# Altium schematic sheet summing_circuit.SchDoc
size A4
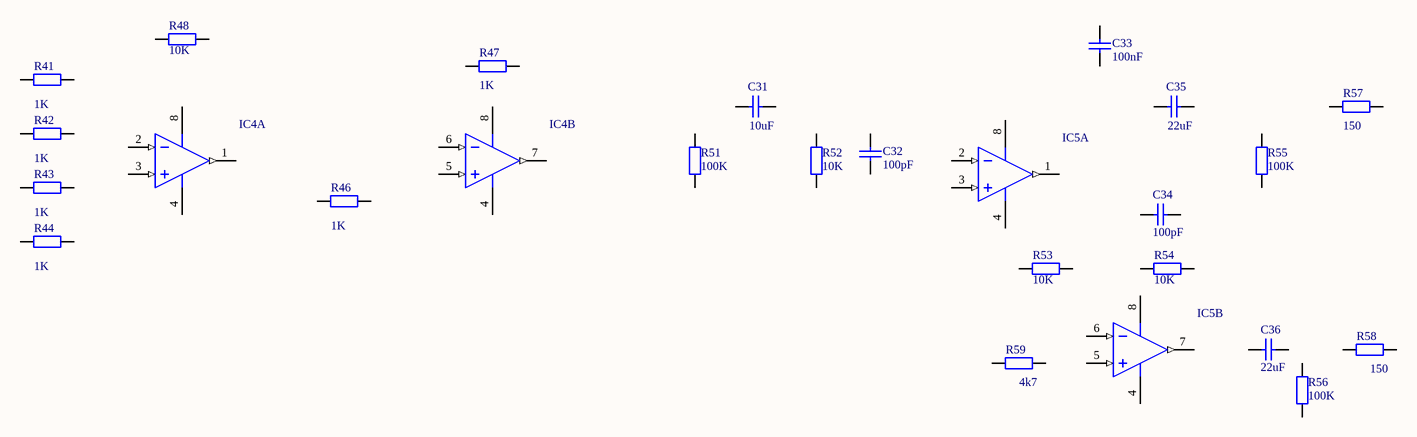
[diagram p0: summing_circuit.SchDoc]

## Parts
C31  value 10uF  [RAD-0.3]  (hidden comment: Cap)
C32  value 100pF  [RAD-0.3]  (hidden comment: Cap)
C33  value 100nF  [RAD-0.3]  (hidden comment: Cap)
C34  value 100pF  [RAD-0.3]  (hidden comment: Cap)
C35  value 22uF  [RAD-0.3]  (hidden comment: Cap)
C36  value 22uF  [RAD-0.3]  (hidden comment: Cap)
IC4  LM833DR2G  [ONSC-SOIC-8-751-07_V]  (value not drawn)  (parts A,B of 2)
IC5  LM833DR2G  [ONSC-SOIC-8-751-07_V]  (value not drawn)  (parts A,B of 2)
R41  value 1K  [AXIAL-0.4]  (hidden comment: Res2)
R42  value 1K  [AXIAL-0.4]  (hidden comment: Res2)
R43  value 1K  [AXIAL-0.4]  (hidden comment: Res2)
R44  value 1K  [AXIAL-0.4]  (hidden comment: Res2)
R46  value 1K  [AXIAL-0.4]  (hidden comment: Res2)
R47  value 1K  [AXIAL-0.4]  (hidden comment: Res2)
R48  value 10K  [AXIAL-0.4]  (hidden comment: Res2)
R51  value 100K  [AXIAL-0.4]  (hidden comment: Res2)
R52  value 10K  [AXIAL-0.4]  (hidden comment: Res2)
R53  value 10K  [AXIAL-0.4]  (hidden comment: Res2)
R54  value 10K  [AXIAL-0.4]  (hidden comment: Res2)
R55  value 100K  [AXIAL-0.4]  (hidden comment: Res2)
R56  value 100K  [AXIAL-0.4]  (hidden comment: Res2)
R57  value 150  [AXIAL-0.4]  (hidden comment: Res2)
R58  value 150  [AXIAL-0.4]  (hidden comment: Res2)
R59  value 4k7  [AXIAL-0.4]  (hidden comment: Res2)

## Nets

Not connected (* = marked no-connect by the designer): C31 1 2; C32 1 2; C33 1 2; C34 1 2; C35 1 2; C36 1 2; IC4 1(OUT1) 2(IN1-) 3(IN1+) 4(VEE) 5(IN2+) 6(IN2-) 7(OUT2) 8(VCC); IC5 1(OUT1) 2(IN1-) 3(IN1+) 4(VEE) 5(IN2+) 6(IN2-) 7(OUT2) 8(VCC); R41 1 2; R42 1 2; R43 1 2; R44 1 2; R46 1 2; R47 1 2; R48 1 2; R51 1 2; R52 1 2; R53 1 2; R54 1 2; R55 1 2; R56 1 2; R57 1 2; R58 1 2; R59 1 2

## Library data of the parts
C31 C32 C34 C35 = Cap: Capacitor; Published: 8-Jun-2000; LatestRevisionDate: 17-Jul-2002; LatestRevisionNote: Re-released for DXP Platform.; PackageReference: RAD-0.3; Publisher: Altium Limited; PackageDescription: Radial Cap, Thru-Hole; 2 Leads; 0.3 in Pin Spacing
C33 = Cap_3: Capacitor; Published: 8-Jun-2000; LatestRevisionDate: 17-Jul-2002; LatestRevisionNote: Re-released for DXP Platform.; PackageReference: RAD-0.3; Publisher: Altium Limited; PackageDescription: Radial Cap, Thru-Hole; 2 Leads; 0.3 in Pin Spacing
C36 = Cap_5: Capacitor; Published: 8-Jun-2000; LatestRevisionDate: 17-Jul-2002; LatestRevisionNote: Re-released for DXP Platform.; PackageReference: RAD-0.3; Publisher: Altium Limited; PackageDescription: Radial Cap, Thru-Hole; 2 Leads; 0.3 in Pin Spacing
IC4 IC5 = opamp_LM833: Low Noise, Audio Dual Operational Amplifier, -40 to 85 degC, 8-Pin SOIC, Pb-Free, Tape and Reel; Manufacturer: On Semiconductor; GBW Typ (MHz): 15; SR Typ (V/uS): 7; PackageReference: SOIC-8-751-07; ComponentLink3URL: http://www.onsemi.com/pub_link/Collateral/751-07.PDF; ComponentLink2URL: http://www.onsemi.cn/pub_link/Collateral/LM833-D.PDF; PackageVersion: Rev. AK, 02/2011; ComponentLink2Description: Datasheet; Mounting Technology: Surface Mount; Packing: Tape and Reel; PackageDescription: 8-Pin Small Outline Integrated Circuit, Body 4.9 x 3.9 mm, Pitch 1.27 mm; RoHS: TRUE; ComponentLink3Description: Package Specification; DatasheetVersion: Rev. 6; ComponentLink1URL: http://www.onsemi.com/; PartNumber: LM833DR2G; ComponentLink1Description: Manufacturer URL
R41-R44 R46 R47 R57-R59 = Res2: Resistor; Published: 8-Jun-2000; LatestRevisionDate: 17-Jul-2002; LatestRevisionNote: Re-released for DXP Platform.; PackageReference: AXIAL-0.4; Publisher: Altium Limited; PackageDescription: Axial Device, Thru-Hole; 2 Leads; 0.4 in Pin Spacing
R48 R52-R54 = Res2_3: Resistor; Published: 8-Jun-2000; LatestRevisionDate: 17-Jul-2002; LatestRevisionNote: Re-released for DXP Platform.; PackageReference: AXIAL-0.4; Publisher: Altium Limited; PackageDescription: Axial Device, Thru-Hole; 2 Leads; 0.4 in Pin Spacing
R51 R55 R56 = Res2_5: Resistor; Published: 8-Jun-2000; LatestRevisionDate: 17-Jul-2002; LatestRevisionNote: Re-released for DXP Platform.; PackageReference: AXIAL-0.4; Publisher: Altium Limited; PackageDescription: Axial Device, Thru-Hole; 2 Leads; 0.4 in Pin Spacing